# Altium schematic sheet ET-POWER.SchDoc
size A4
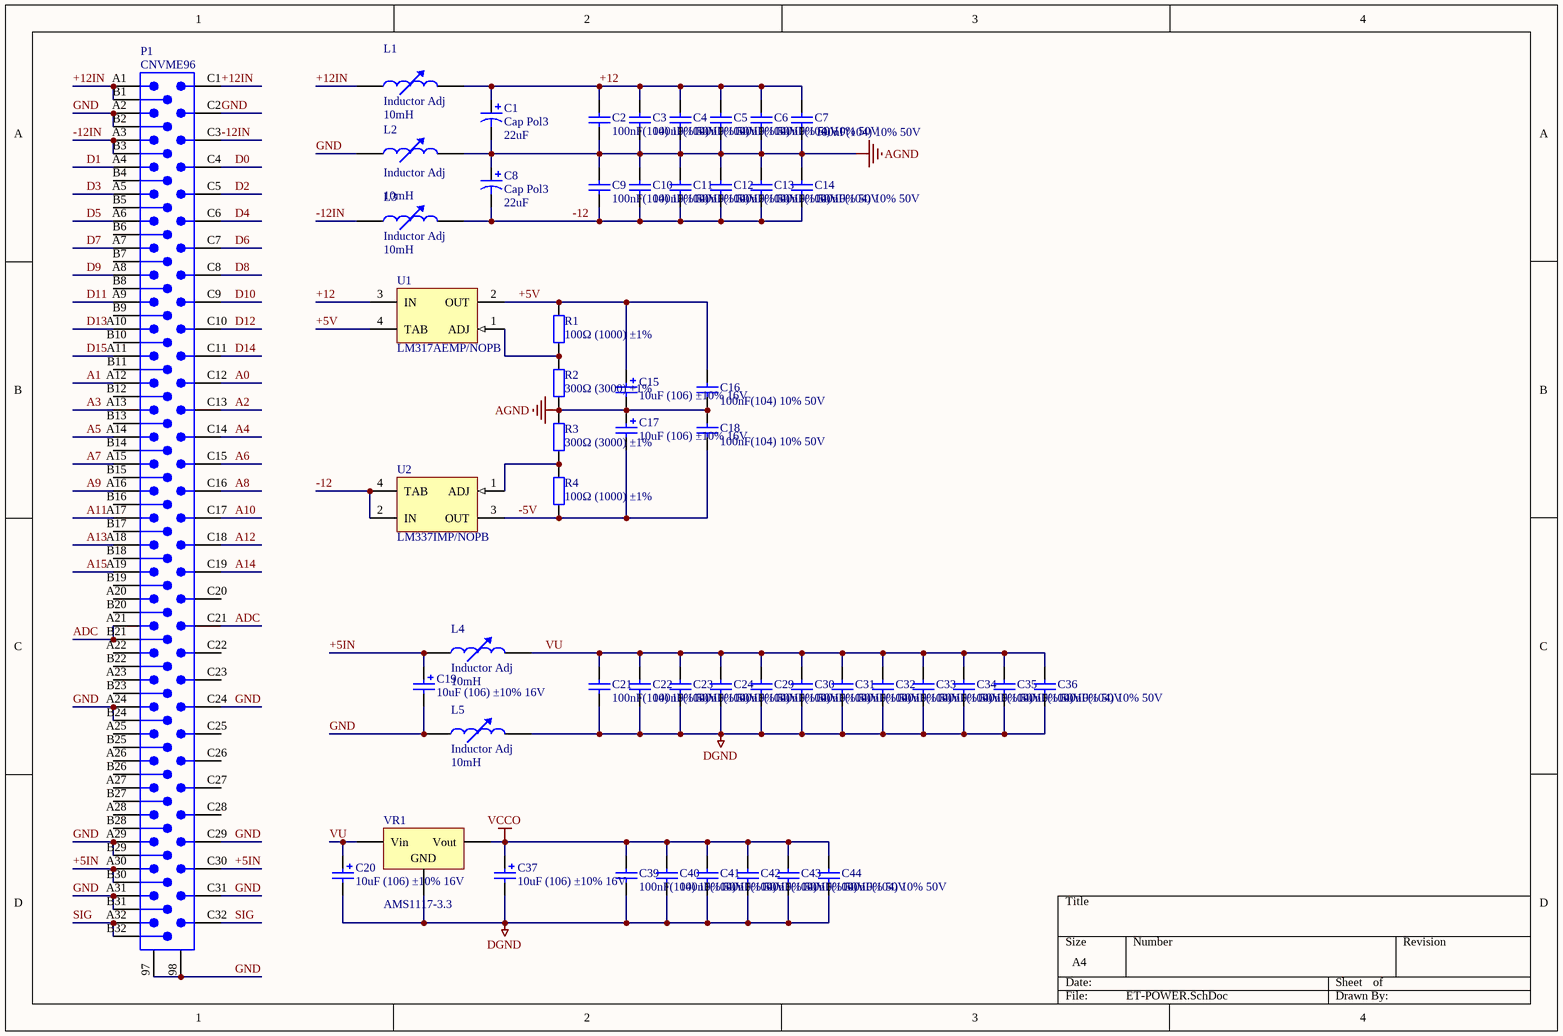
[diagram p0: ET-POWER.SchDoc]

## Parts
C1  Cap Pol3  value 22uF  [2220]
C2  100nF(104) 10% 50V  [LC-0805_C]
C3  100nF(104) 10% 50V  [LC-0805_C]
C4  100nF(104) 10% 50V  [LC-0805_C]
C5  100nF(104) 10% 50V  [LC-0805_C]
C6  100nF(104) 10% 50V  [LC-0805_C]
C7  100nF(104) 10% 50V  [LC-0805_C]
C8  Cap Pol3  value 22uF  [2220]
C9  100nF(104) 10% 50V  [LC-0805_C]
C10  100nF(104) 10% 50V  [LC-0805_C]
C11  100nF(104) 10% 50V  [LC-0805_C]
C12  100nF(104) 10% 50V  [LC-0805_C]
C13  100nF(104) 10% 50V  [LC-0805_C]
C14  100nF(104) 10% 50V  [LC-0805_C]
C15  10uF (106) ±10% 16V  [LC-CASE-A_3216]
C16  100nF(104) 10% 50V  [LC-0805_C]
C17  10uF (106) ±10% 16V  [LC-CASE-A_3216]
C18  100nF(104) 10% 50V  [LC-0805_C]
C19  10uF (106) ±10% 16V  [LC-CASE-A_3216]
C20  10uF (106) ±10% 16V  [LC-CASE-A_3216]
C21  100nF(104) 10% 50V  [LC-0805_C]
C22  100nF(104) 10% 50V  [LC-0805_C]
C23  100nF(104) 10% 50V  [LC-0805_C]
C24  100nF(104) 10% 50V  [LC-0805_C]
C29  100nF(104) 10% 50V  [LC-0805_C]
C30  100nF(104) 10% 50V  [LC-0805_C]
C31  100nF(104) 10% 50V  [LC-0805_C]
C32  100nF(104) 10% 50V  [LC-0805_C]
C33  100nF(104) 10% 50V  [LC-0805_C]
C34  100nF(104) 10% 50V  [LC-0805_C]
C35  100nF(104) 10% 50V  [LC-0805_C]
C36  100nF(104) 10% 50V  [LC-0805_C]
C37  10uF (106) ±10% 16V  [LC-CASE-A_3216]
C39  100nF(104) 10% 50V  [LC-0805_C]
C40  100nF(104) 10% 50V  [LC-0805_C]
C41  100nF(104) 10% 50V  [LC-0805_C]
C42  100nF(104) 10% 50V  [LC-0805_C]
C43  100nF(104) 10% 50V  [LC-0805_C]
C44  100nF(104) 10% 50V  [LC-0805_C]
L1  Inductor Adj  value 10mH  [AXIAL-0.4]
L2  Inductor Adj  value 10mH  [AXIAL-0.4]
L3  Inductor Adj  value 10mH  [AXIAL-0.4]
L4  Inductor Adj  value 10mH  [AXIAL-0.4]
L5  Inductor Adj  value 10mH  [AXIAL-0.4]
P1  CNVME96  [CNVME96]
R1  100Ω (1000) ±1%  [LC-0805_R]
R2  300Ω (3000) ±1%  [LC-0805_R]
R3  300Ω (3000) ±1%  [LC-0805_R]
R4  100Ω (1000) ±1%  [LC-0805_R]
U1  LM317AEMP/NOPB  [MP04A_N]
U2  LM337IMP/NOPB  [MP04A_N]
VR1  AMS1117-3.3  [LC-SOT-223]

## Nets
AGND: C1.2 C2.1 C3.1 C4.1 C5.1 C6.1 C7.1 C8.1 C9.2 C10.2 C11.2 C12.2 C13.2 C14.2 C15.2 C16.1 C17.1 C18.2 L2.2 R2.1 R3.2
DGND: C20.2 C21.1 C22.1 C23.1 C24.1 C29.1 C30.1 C31.1 C32.1 C33.1 C34.1 C35.1 C36.1 C37.2 C39.1 C40.1 C41.1 C42.1 C43.1 C44.1 L5.2 VR1.1(GND)
VCCO: C37.1 C39.2 C40.2 C41.2 C42.2 C43.2 C44.2 VR1.2(Vout)
+5IN: C19.1 L4.1 P1.A30 P1.B30 P1.C30
+5V: C15.1 C16.2 R1.2 U1.2(OUT) U1.4(TAB)
+12: C1.1 C2.2 C3.2 C4.2 C5.2 C6.2 C7.2 L1.2 U1.3(IN)
+12IN: L1.1 P1.A1 P1.B1 P1.C1
-5V: C17.2 C18.1 R4.1 U2.3(OUT)
-12: C8.2 C9.1 C10.1 C11.1 C12.1 C13.1 C14.1 L3.2 U2.2(IN) U2.4(TAB)
-12IN: L3.1 P1.A3 P1.B3 P1.C3
A0: P1.C12
A1: P1.A12
A2: P1.C13
A3: P1.A13
A4: P1.C14
A5: P1.A14
A6: P1.C15
A7: P1.A15
A8: P1.C16
A9: P1.A16
A10: P1.C17
A11: P1.A17
A12: P1.C18
A13: P1.A18
A14: P1.C19
A15: P1.A19
ADC: P1.A21 P1.B21 P1.C21
D0: P1.C4
D1: P1.A4
D2: P1.C5
D3: P1.A5
D4: P1.C6
D5: P1.A6
D6: P1.C7
D7: P1.A7
D8: P1.C8
D9: P1.A8
D10: P1.C9
D11: P1.A9
D12: P1.C10
D13: P1.A10
D14: P1.C11
D15: P1.A11
GND: C19.2 L2.1 L5.1 P1.97 P1.98 P1.A2 P1.A24 P1.A29 P1.A31 P1.B2 P1.B24 P1.B29 P1.B31 P1.C2 P1.C24 P1.C29 P1.C31
SIG: P1.A32 P1.B32 P1.C32
VU: C20.1 C21.2 C22.2 C23.2 C24.2 C29.2 C30.2 C31.2 C32.2 C33.2 C34.2 C35.2 C36.2 L4.2 VR1.3(Vin)
NetR1_1: R1.1 R2.2 U1.1(ADJ)
NetR3_1: R3.1 R4.2 U2.1(ADJ)

Not connected (* = marked no-connect by the designer): P1 A20 A22 A23 A25 A26 A27 A28 B4 B5 B6 B7 B8 B9 B10 B11 B12 B13 B14 B15 B16 B17 B18 B19 B20 B22 B23 B25 B26 B27 B28 C20 C22 C23 C25 C26 C27 C28

## Library data of the parts
C1 C8 = Cap Pol3: Polarized Capacitor (Surface Mount); Published: 8-Jun-2000; LatestRevisionDate: 29-May-2009; LatestRevisionNote: IPC-7351 Footprint Added.; PackageReference: C0805; Publisher: Altium Limited; PackageDescription: Chip Capacitor
C2-C7 C9-C14 C16 C18 C21-C24 C29-C36 C39-C44 = 0805 100nF(104) 10% 50V: 贴片电容; ComponentLink1Description: 供应商链接; ComponentLink1URL: http://www.szlcsc.com/product/details_50686.html; Package: 0805; Supplier: LC; SuppliersPartNumber: C49678
C15 C17 C19 C20 C37 = 3216 10uF (106) 10% 16V: 钽电容; ComponentLink1Description: 供应商链接; ComponentLink1URL: http://www.szlcsc.com/product/details_7643.html; Package: 3216; Supplier: LC; SuppliersPartNumber: C7171
L1-L5 = Inductor Adj: Adjustable Inductor; Set Position: 0.5; Published: 24-Mar-1999; LatestRevisionDate: 17-Jul-2002; LatestRevisionNote: Re-released for DXP Platform.; PackageReference: AXIAL-0.8; Publisher: Altium Limited; PackageDescription: Axial Device, Thru-Hole; 2 Leads; 0.8 in Pin Spacing
P1 = CNVME96: 96-Pin Connector (3x32 2.54mm grid); Text Field6: Alternate Layout Available; Text Field7: Published 14-Feb-2002
R1 R4 = 0805 100Ω (1000) 1%: 贴片电阻; ComponentLink1Description: 供应商链接; ComponentLink1URL: http://www.szlcsc.com/product/details_18096.html; Package: 0805; Supplier: LC; SuppliersPartNumber: C17408
R2 R3 = 0805 300Ω (3000) 1%: 贴片电阻; ComponentLink1Description: 供应商链接; ComponentLink1URL: http://www.szlcsc.com/product/details_18305.html; Package: 0805; Supplier: LC; SuppliersPartNumber: C17617
U1 = LM317AEMP/NOPB: 3-Terminal Adjustable Regulator, 4-pin SOT-223, Pb-Free; Manufacturer: National Semiconductor; PackageTopMarking: XYTT*N07A; PowerWise: N; CompType: LDO IC; High-Reliability: Y; DatasheetVersion: Apr-2007; PackageVersion: revB, Apr-2003; PackageReference: MP04A; PackageDescription: Molded SOT-223, 6.50 x 3.56 x 1.6mm Body, 4 Lead, 2.3mm Pitch; PartNumber: LM317AEMP/NOPB; RoHS: Y; PinCount: 4; Code_JEDEC: TO-261-AA; Code_IPC: SOT223-4; ComponentLink1Description: Manufacturer URL; ComponentLink1URL: http://www.national.com/; ComponentLink2Description: LM317 Datasheet; ComponentLink2URL: http://www.national.com/ds/LM/LM317.pdf; ComponentLink3Description: LM317 Web Page; ComponentLink3URL: http://www.national.com/pf/LM/LM317.html; ComponentLink4Description: MP04A Package Page; ComponentLink4URL: http://www.national.com/packaging/folders/mp04a.html
U2 = LM337IMP/NOPB: 3-Terminal Adjustable Negative Regulator, 4-pin SOT-223, Pb-Free; Manufacturer: National Semiconductor; PackageTopMarking: XYTT*N02A; PowerWise: N; CompType: LDO IC; Published: 1-Mar-2010; DatasheetVersion: Nov-2004; PackageVersion: revB, Apr-2003; PackageReference: MP04A; Publisher: Altium Limited; PackageDescription: Molded SOT-223, 6.50 x 3.56 x 1.6mm Body, 4 Lead, 2.3mm Pitch; Supplier 1: Digi-Key; Supplier Part Number 1: LM337IMPTR-ND; Supplier 2: Digi-Key; Supplier Part Number 2: LM337IMPCT-ND; Supplier 3: Digi-Key; Supplier Part Number 3: LM337IMPDKR-ND; Supplier 4: Newark; Supplier Part Number 4: 41K4742; PartNumber: LM337IMP/NOPB; RoHS: Y; PinCount: 4; Code_JEDEC: TO-261-AA; Code_IPC: SOT223-4; ComponentLink1Description: LM337 Datasheet; ComponentLink1URL: http://www.national.com/ds/LM/LM337.pdf; ComponentLink2Description: LM337 Web Page; ComponentLink2URL: http://www.national.com/pf/LM/LM337.html; ComponentLink3Description: MP04A Package Page; ComponentLink3URL: http://www.national.com/packaging/folders/mp04a.html
VR1 = SOT-223 AMS1117-3.3: 低压差线性稳压(LDO); ComponentLink1Description: 供应商链接; ComponentLink1URL: http://www.szlcsc.com/product/details_6652.html; Package: SOT-223; Supplier: LC; SuppliersPartNumber: C6186